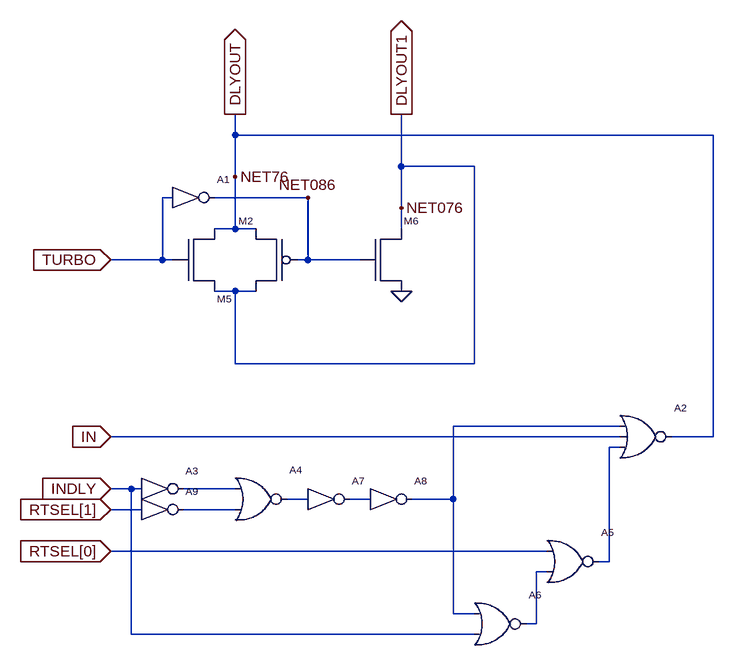
[diagram p0: schematic XDEL_SAE.asc]
XDEL_SAE.asc, the LTspice schematic file:
Version 4
SHEET 1 880 1272
WIRE -224 432 -224 400
WIRE 512 432 -224 432
WIRE 32 480 32 400
WIRE 144 480 32 480
WIRE -224 496 -224 432
WIRE -320 528 -336 528
WIRE -112 528 -256 528
WIRE 32 544 32 480
WIRE -224 576 -224 496
WIRE -224 576 -256 576
WIRE -192 576 -224 576
WIRE 32 576 32 544
WIRE -336 624 -336 528
WIRE -336 624 -416 624
WIRE -320 624 -336 624
WIRE -112 624 -112 528
WIRE -112 624 -128 624
WIRE -32 624 -112 624
WIRE -224 672 -256 672
WIRE -192 672 -224 672
WIRE -224 784 -224 672
WIRE 144 784 144 480
WIRE 144 784 -224 784
WIRE 368 880 112 880
WIRE 368 896 -416 896
WIRE 512 896 512 432
WIRE 512 896 448 896
WIRE 368 912 352 912
WIRE -384 976 -416 976
WIRE -368 976 -384 976
WIRE -224 976 -304 976
WIRE -112 992 -144 992
WIRE -16 992 -48 992
WIRE 112 992 112 880
WIRE 112 992 48 992
WIRE -368 1008 -416 1008
WIRE -224 1008 -304 1008
WIRE 256 1072 -416 1072
WIRE 352 1088 352 912
WIRE 352 1088 336 1088
WIRE 256 1104 240 1104
WIRE 112 1168 112 992
WIRE 144 1168 112 1168
WIRE 240 1184 240 1104
WIRE 240 1184 224 1184
WIRE -384 1200 -384 976
WIRE 144 1200 -384 1200
FLAG 32 672 0
FLAG -416 624 TURBO
IOPIN -416 624 In
FLAG -224 496 NET76
FLAG -224 400 DLYOUT
IOPIN -224 400 Out
FLAG -112 528 NET086
FLAG 32 544 NET076
FLAG 32 400 DLYOUT1
IOPIN 32 400 Out
FLAG -416 976 INDLY
IOPIN -416 976 In
FLAG -416 1008 RTSEL[1]
IOPIN -416 1008 In
FLAG -416 896 IN
IOPIN -416 896 In
FLAG -416 1072 RTSEL[0]
IOPIN -416 1072 In
SYMBOL PMOS -176 624 M0
SYMATTR InstName M2
SYMBOL NMOS -272 624 M180
SYMATTR InstName M5
SYMBOL NMOS 16 624 R0
SYMATTR InstName M6
SYMBOL INV -304 528 R0
SYMATTR InstName A1
SYMBOL NOR3 400 896 R0
SYMATTR InstName A2
SYMBOL INV -352 976 R0
SYMATTR InstName A3
SYMBOL NOR -192 992 R0
SYMATTR InstName A4
SYMBOL NOR 288 1088 R0
SYMATTR InstName A5
SYMBOL NOR 176 1184 R0
SYMATTR InstName A6
SYMBOL INV -96 992 R0
SYMATTR InstName A7
SYMBOL INV 0 992 R0
SYMATTR InstName A8
SYMBOL INV -352 1008 R0
SYMATTR InstName A9

The netlist it stands for:
* XDEL_SAE.asc
M2 DLYOUT NET086 DLYOUT1 DLYOUT1
M5 DLYOUT1 TURBO DLYOUT DLYOUT
M6 DLYOUT1 NET086 0 0
A1 TURBO 0 0 0 0 NET086 0 0 BUF
A2 DLYOUT N001 IN N002 DLYOUT DLYOUT DLYOUT DLYOUT OR
A3 INDLY 0 0 0 0 N003 0 0 BUF
A4 0 N003 0 N006 0 0 N004 0 OR
A5 0 RTSEL[0] 0 N007 0 0 N002 0 OR
A6 0 N001 0 INDLY 0 0 N007 0 OR
A7 N004 0 0 0 0 N005 0 0 BUF
A8 N005 0 0 0 0 N001 0 0 BUF
A9 RTSEL[1] 0 0 0 0 N006 0 0 BUF
.model NMOS NMOS
.model PMOS PMOS
.lib standard.mos
.backanno
.end